# EAGLE design Adafruit EYESPI Pi Beret (EAGLE 9.6.2)
COMPANY: ADAFRUIT INDUSTRIES; DRAWN: K. TOWNSEND; REV: A
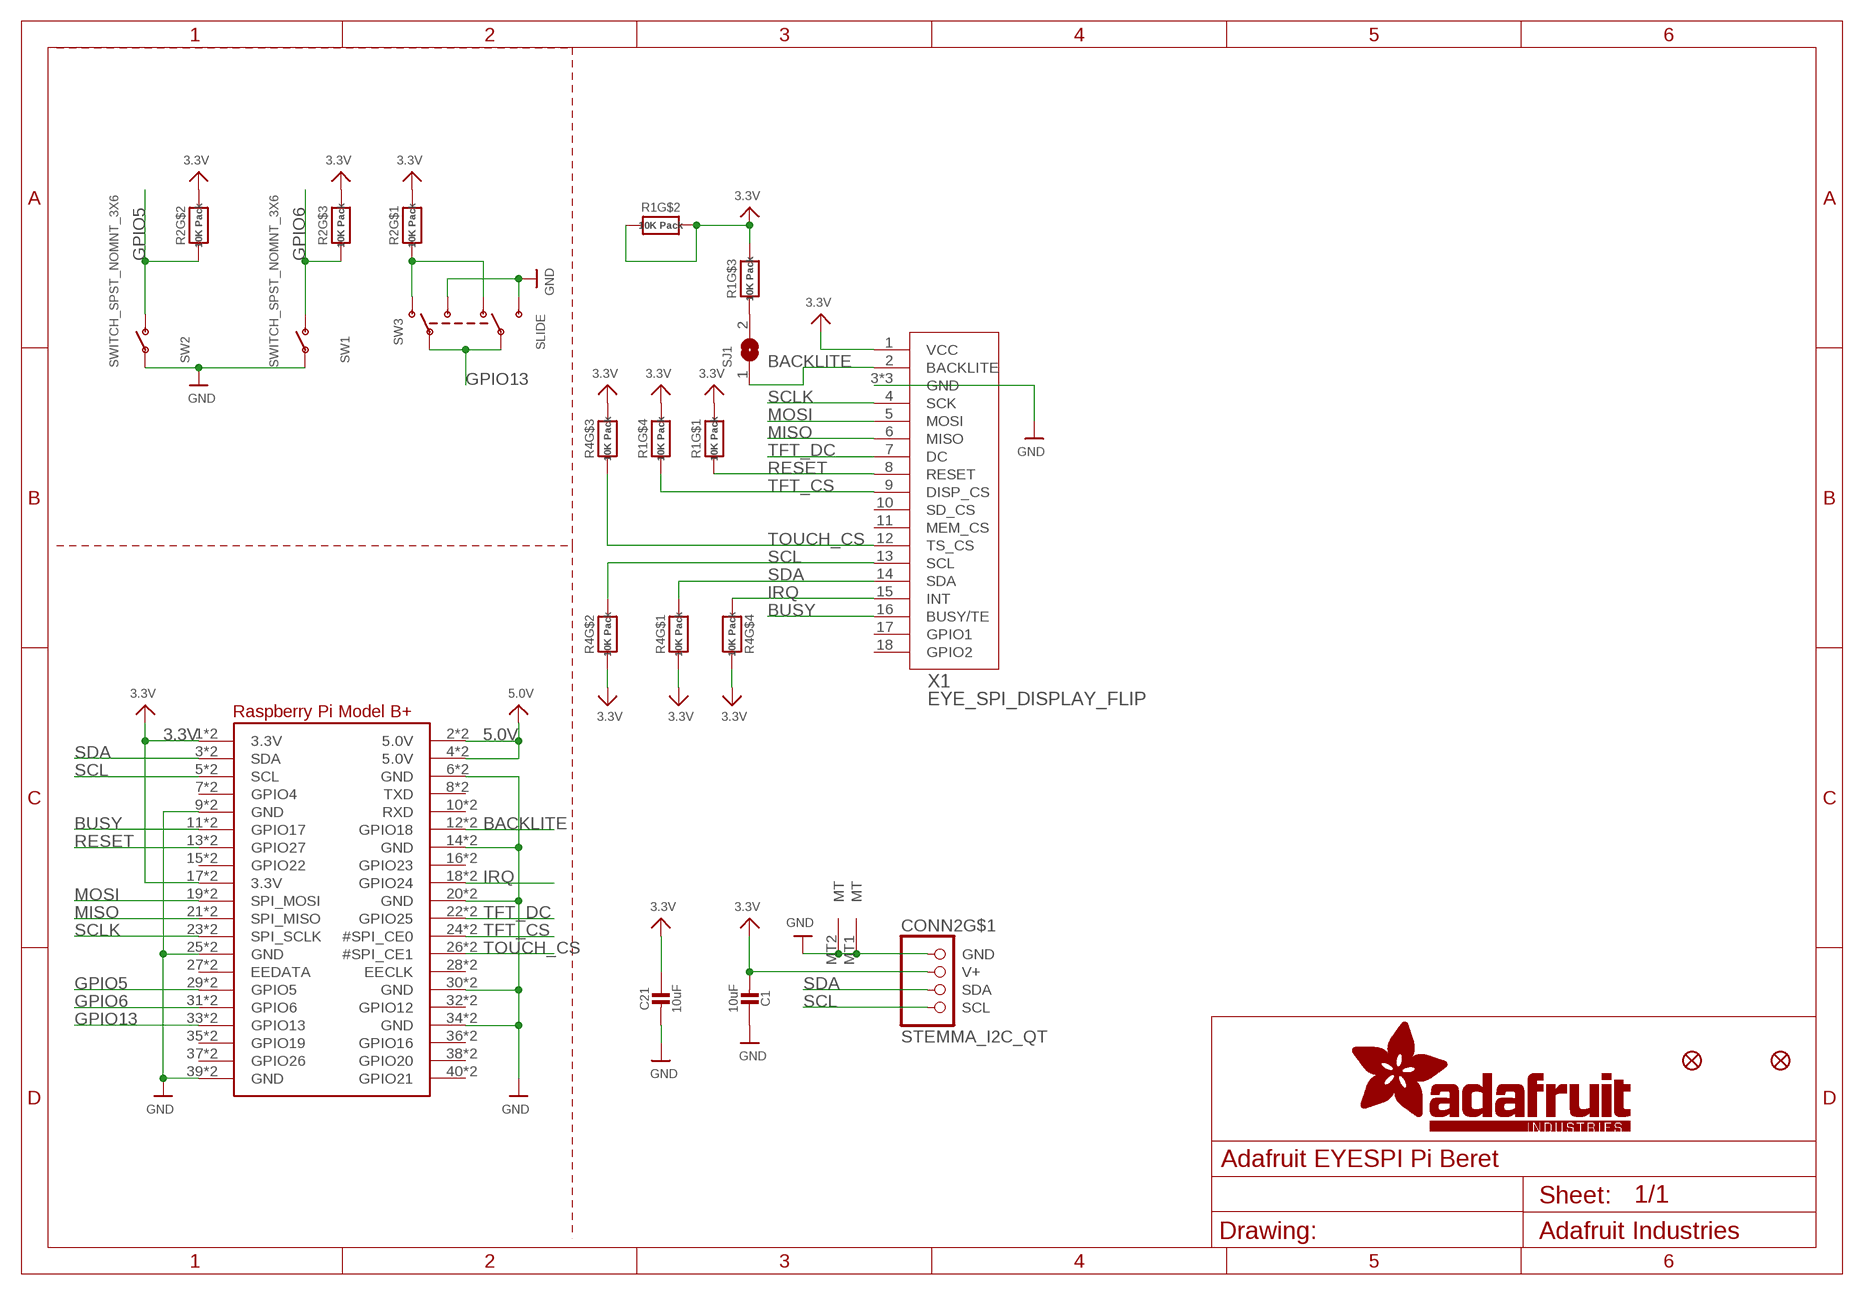
[diagram p0: schematic, sheet 1]

## Parts
C1  10uF  CAP_CERAMIC0805-NOOUTLINE  [0805-NO]
C21  10uF  CAP_CERAMIC0805-NOOUTLINE  [0805-NO]
CONN2  STEMMA_I2C_QT  [JST_SH4]
FID1  FIDUCIAL_1MM  [FIDUCIAL_1MM]
FID4  FIDUCIAL_1MM  [FIDUCIAL_1MM]
R1  10K Pack  RESISTOR_4PACK  [RESPACK_4X0603]
R2  10K Pack  RESISTOR_4PACK  [RESPACK_4X0603]
R4  10K Pack  RESISTOR_4PACK  [RESPACK_4X0603]
RPI2  RASPBERRYPI_BPLUS_2X20_THMSMT  [RASPI_2X20_THMSMT]
SJ1  SOLDERJUMPERCLOSED  [SOLDERJUMPER_CLOSEDWIRE]
SW1  SWITCH_SPST_NOMNT_3X6  [TACTILE_3X6MM]
SW2  SWITCH_SPST_NOMNT_3X6  [TACTILE_3X6MM]
SW3  SLIDE  SWITCH_DPDTEG1390  [EG1390]
X1  EYE_SPI_DISPLAY_FLIP  [EYE_SPI_DISPLAY_BOTCONTACT]

## Nets
3.3V: C1.2 C21.1 CONN2.2(V+) R1.2 R1.5 R1.6 R1.7 R1.8 R2.6 R2.7 R2.8 R4.1 R4.2 R4.5 R4.6 RPI2.1(3.3V) RPI2.17(3.3V) RPI2.S1(3.3V) RPI2.S17(3.3V) X1.1(VCC)
5.0V: RPI2.2(5.0V) RPI2.4(5.0V) RPI2.S2(5.0V) RPI2.S4(5.0V)
BACKLITE: RPI2.12(GPIO18) RPI2.S12(GPIO18) SJ1.1 X1.2(BACKLITE)
BUSY: RPI2.11(GPIO17) RPI2.S11(GPIO17) X1.16(BUSY/TE)
GND: C1.1 C21.2 CONN2.1(GND) CONN2.MT1(MT) CONN2.MT2(MT) RPI2.6(GND) RPI2.9(GND) RPI2.14(GND) RPI2.20(GND) RPI2.25(GND) RPI2.30(GND) RPI2.34(GND) RPI2.39(GND) RPI2.S6(GND) RPI2.S9(GND) RPI2.S14(GND) RPI2.S20(GND) RPI2.S25(GND) RPI2.S30(GND) RPI2.S34(GND) RPI2.S39(GND) SW1.P$1(P) SW2.P$1(P) SW3.S1 SW3.S2 X1.3(GND) X1.SUPPORT1(GND) X1.SUPPORT2(GND)
GPIO5: R2.2 RPI2.29(GPIO5) RPI2.S29(GPIO5) SW2.P$2(S)
GPIO6: R2.3 RPI2.31(GPIO6) RPI2.S31(GPIO6) SW1.P$2(S)
GPIO13: RPI2.33(GPIO13) RPI2.S33(GPIO13) SW3.P1 SW3.P2
IRQ: R4.4 RPI2.18(GPIO24) RPI2.S18(GPIO24) X1.15(INT)
MISO: RPI2.21(SPI_MISO) RPI2.S21(SPI_MISO) X1.6(MISO)
MOSI: RPI2.19(SPI_MOSI) RPI2.S19(SPI_MOSI) X1.5(MOSI)
N$1: R1.3 SJ1.2
N$3: R2.1 SW3.O1 SW3.O2
RESET: R1.1 RPI2.13(GPIO27) RPI2.S13(GPIO27) X1.8(RESET)
SCL: CONN2.4(SCL) R4.7 RPI2.5(SCL) RPI2.S5(SCL) X1.13(SCL)
SCLK: RPI2.23(SPI_SCLK) RPI2.S23(SPI_SCLK) X1.4(SCK)
SDA: CONN2.3(SDA) R4.8 RPI2.3(SDA) RPI2.S3(SDA) X1.14(SDA)
TFT_CS: R1.4 RPI2.24(#SPI_CE0) RPI2.S24(#SPI_CE0) X1.9(DISP_CS)
TFT_DC: RPI2.22(GPIO25) RPI2.S22(GPIO25) X1.7(DC)
TOUCH_CS: R4.3 RPI2.26(#SPI_CE1) RPI2.S26(#SPI_CE1) X1.12(TS_CS)
Unconnected: R2.4 R2.5 RPI2.7(GPIO4) RPI2.8(TXD) RPI2.10(RXD) RPI2.15(GPIO22) RPI2.16(GPIO23) RPI2.27(EEDATA) RPI2.28(EECLK) RPI2.32(GPIO12) RPI2.35(GPIO19) RPI2.36(GPIO16) RPI2.37(GPIO26) RPI2.38(GPIO20) RPI2.40(GPIO21) RPI2.S7(GPIO4) RPI2.S8(TXD) RPI2.S10(RXD) RPI2.S15(GPIO22) RPI2.S16(GPIO23) RPI2.S27(EEDATA) RPI2.S28(EECLK) RPI2.S32(GPIO12) RPI2.S35(GPIO19) RPI2.S36(GPIO16) RPI2.S37(GPIO26) RPI2.S38(GPIO20) RPI2.S40(GPIO21) X1.10(SD_CS) X1.11(MEM_CS) X1.17(GPIO1) X1.18(GPIO2)

## Library data of the parts
C1 C21 = microbuilder:CAP_CERAMIC: Ceramic Capacitors For new designs, use the packages preceded by an '_' character since they are more reliable: The following footprints should be used on most boards: _0402 - Standard footprint for regular board layouts _0603 - Standard footprint for regular board layouts _0805 - Standard footprint for regular board layouts _1206 - Standard footprint for regular board layouts For extremely tight-pitch boards where space is at a premium, the following 'micro-pitch' footprints can be used (smaller pads, no silkscreen outline, etc.): _0402MP - Micro-pitch footprint for very dense/compact boards _0603MP - Micro-pitch footprint for very dense/compact boards _0805MP - Micro-pitch footprint for very dense/compact boards _1206MP - Micro-pitch footprint for very dense/compact boards
CONN2 = adafruit_electromech:STEMMA_I2C; LCSC: C2845363
FID1 FID4 = microbuilder:FIDUCIAL: Fiducial Alignment Points Various fiducial points for machine vision alignment.; BOM: EXCLUDE
R1 R2 R4 = microbuilder:RESISTOR_4PACK: Resistor Packs (4 resistors) 4 x 0603 10K 1/16W - Digikey: YC164J-10KCT-ND
RPI2 = adafruit_sbc:RASPBERRYPI_BPLUS
SJ1 = microbuilder:SOLDERJUMPER: SMD Solder JUMPER Solder the two pads together to create a connection, or remove the solder to break it. REFLOW - Use this footprint for solder paste and reflow ovens. WAVE - Use this footprint for hand-soldering (larger pads). CLOSED - Has a trace between the two pads to ensure it is closed by default. The trace needs to be cut to disable the jumper, and can be closed again by creating a solder bridge between the two pads.
SW1 SW2 = adafruit_electromech:SWITCH_SPST_NOMNT
SW3 = adafruit_electromech:SWITCH_DPDT: Switch - DPDT A DPDT Switch acts like an SPDT switch, but has a pair of switches instead of just one. Vertical - 0.3A @ 6V SMT - Digikey: JS202011SCQN; LCSC: C2837066
X1 = adafruit_display:EYE_SPI_DISPLAY; LCSC: C2856802

## Net classes
1 power: width 0.305 mm

## Board
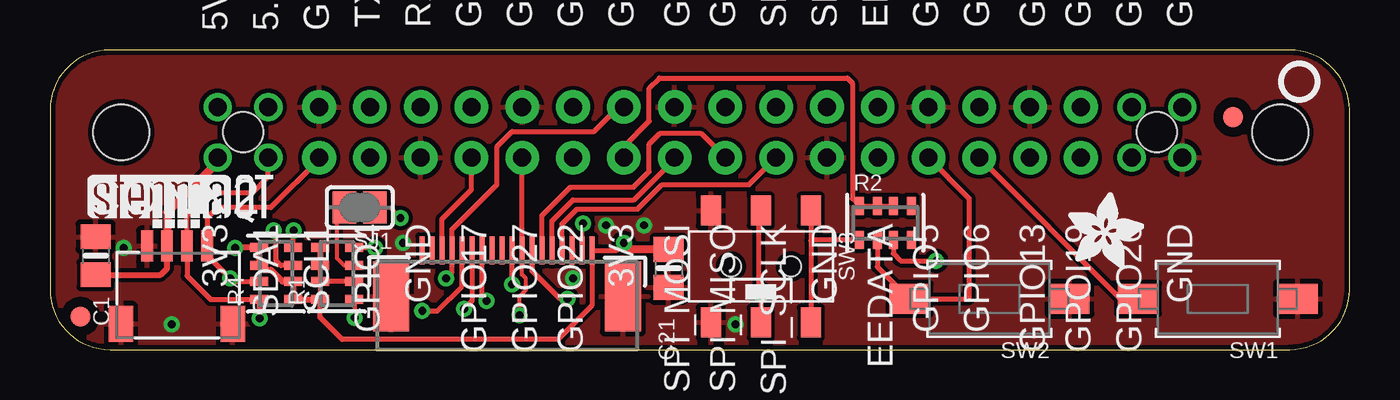
[diagram p1: board, top side]
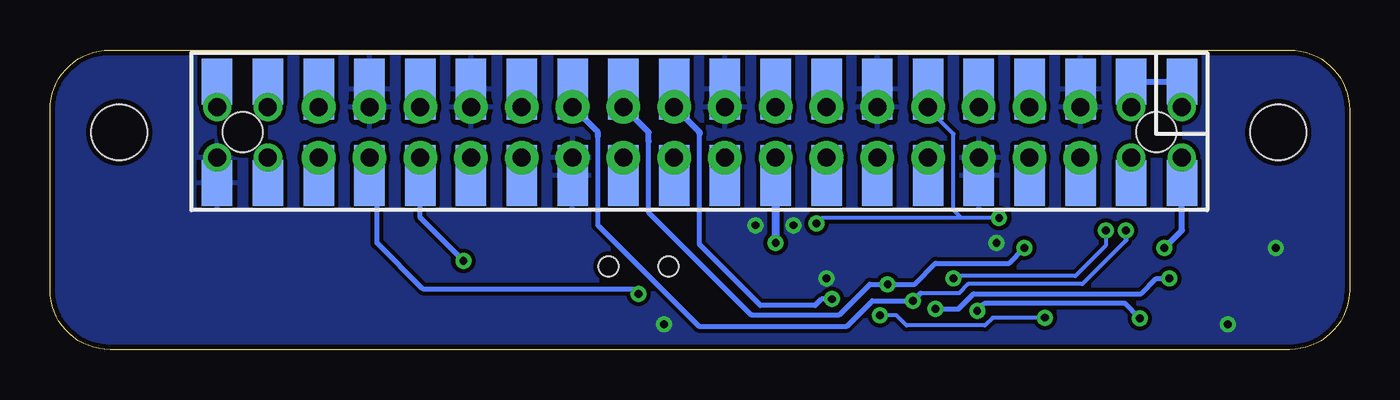
[diagram p2: board, bottom side, seen from below]

Size 65 x 15 mm. Coordinates in mm from the lower left corner, seen from the top.
Outline: 0,12 0,3 arc90 3,0 62,0 arc90 65,3 65,12 arc90 62,15 3,15 arc90 0,12
Copper layers (1*16): Top 0.035mm / dielectric 1.5mm / Bottom 0.035mm
Design rules "adafruit *": minimum track width 8mil, minimum drill 15.5mil, track to track 8mil, track to pad 8mil, pad to pad 8mil, via to via 8mil, smd to smd 8mil, copper to edge 10mil, drill to drill 8mil, minimum pad ring 10mil, minimum via ring 8mil, stop-mask expansion 2mil, vias tented up to drill 20mil, thermal gap 10mil
Holes 2.79 mm at 3.56,10.88 61.53,10.88

### Footprints (pad centres in the part's own frame; a part is rotated, then mirrored left to right if it is on the bottom)
0805-NO = smd 1.24 x 1.5: 1 -0.95,0; 2 0.95,0
JST_SH4 = smd 0.6 x 1.55: 1 -1.5,2.006; 2 -0.5,2.006; 3 0.5,2.006; 4 1.5,2.006 | smd 1.2 x 1.8: MT1 -2.8,-1.894; MT2 2.8,-1.894
FIDUCIAL_1MM = smd 1 x 1: 1 0,0
RESPACK_4X0603 = smd 0.45 x 0.9: 1 -1.3,-0.85; 2 -0.4,-0.85; 3 0.4,-0.85; 4 1.3,-0.85; 5 1.3,0.85; 6 0.4,0.85; 7 -0.4,0.85; 8 -1.3,0.85
RASPI_2X20_THMSMT = drill 0.9 pad 1.27: 1 -24.13,-1.27; 2 -24.13,1.27; 3 -21.59,-1.27; 4 -21.59,1.27; 37 21.59,-1.27; 38 21.59,1.27; 39 24.13,-1.27; 40 24.13,1.27 | drill 0.9 pad 1.676: 5 -19.05,-1.27; 6 -19.05,1.27; 7 -16.51,-1.27; 8 -16.51,1.27; 9 -13.97,-1.27; 10 -13.97,1.27; 11 -11.43,-1.27; 12 -11.43,1.27; 13 -8.89,-1.27; 14 -8.89,1.27; 15 -6.35,-1.27; 16 -6.35,1.27; 17 -3.81,-1.27; 18 -3.81,1.27; 19 -1.27,-1.27; 20 -1.27,1.27; 21 1.27,-1.27; 22 1.27,1.27; 23 3.81,-1.27; 24 3.81,1.27; 25 6.35,-1.27; 26 6.35,1.27; 27 8.89,-1.27; 28 8.89,1.27; 29 11.43,-1.27; 30 11.43,1.27; 31 13.97,-1.27; 32 13.97,1.27; 33 16.51,-1.27; 34 16.51,1.27; 35 19.05,-1.27; 36 19.05,1.27 | smd 1.524 x 2.286 bottom: S1 -24.13,-2.542; S2 -24.13,2.538; S3 -21.59,-2.542; S4 -21.59,2.538; S37 21.59,-2.542; S38 21.59,2.538; S39 24.13,-2.542; S40 24.13,2.538 | smd 1.524 x 3.048 bottom: S5 -19.05,-2.161; S6 -19.05,2.157; S7 -16.51,-2.161; S8 -16.51,2.157; S9 -13.97,-2.161; S10 -13.97,2.157; S11 -11.43,-2.161; S12 -11.43,2.157; S13 -8.89,-2.161; S14 -8.89,2.157; S15 -6.35,-2.161; S16 -6.35,2.157; S17 -3.81,-2.161; S18 -3.81,2.157; S19 -1.27,-2.161; S20 -1.27,2.157; S21 1.27,-2.161; S22 1.27,2.157; S23 3.81,-2.161; S24 3.81,2.157; S25 6.35,-2.161; S26 6.35,2.157; S27 8.89,-2.161; S28 8.89,2.157; S29 11.43,-2.161; S30 11.43,2.157; S31 13.97,-2.161; S32 13.97,2.157; S33 16.51,-2.161; S34 16.51,2.157; S35 19.05,-2.161; S36 19.05,2.157 | hole 2: 22.86,0; -22.86,0
SOLDERJUMPER_CLOSEDWIRE = smd 1.168 x 1.6: 1 -0.762,0; 2 0.762,0 | smd 0.635 x 0.203: WIRE 0,0
TACTILE_3X6MM = smd 2 x 1.5: P$1 -4,0; P$2 4,0
EG1390 = smd 1 x 1.5: O1 -2.5,2.8; O2 -2.5,-2.8; P1 0,2.8; P2 0,-2.8; S1 2.5,2.8; S2 2.5,-2.8 | hole 1: 1.5,0; -1.5,0
EYE_SPI_DISPLAY_BOTCONTACT = smd 0.25 x 1.4: 1 4.25,1.154; 2 3.75,1.154; 3 3.25,1.154; 4 2.75,1.154; 5 2.25,1.154; 6 1.75,1.154; 7 1.25,1.154; 8 0.75,1.154; 9 0.25,1.154; 10 -0.25,1.154; 11 -0.75,1.154; 12 -1.25,1.154; 13 -1.75,1.154; 14 -2.25,1.154; 15 -2.75,1.154; 16 -3.25,1.154; 17 -3.75,1.154; 18 -4.25,1.154 | smd 1.8 x 3.5: SUPPORT1 -5.8,-1.152; SUPPORT2 5.8,-1.152

### Placement (x,y rotation side)
C1  2.29,4.7 270 top
C21  30.94,4.06 270 top
CONN2  6.35,3.17 0 top
FID1  59.18,11.64 0 top
FID4  1.52,1.65 0 top
PLABEL0  [PLABEL0]  46.35,4.83 0 top
PLABEL1  [PLABEL1]  58.04,4.83 0 top
PLABEL2  [PLABEL2]  38.86,0.64 0 top
PLABEL3  [PLABEL3]  18.16,5.97 0 top
PLABEL4  [PLABEL4]  13.59,6.1 90 top
PLABEL5  [PLABEL5]  64.52,4.95 0 bottom
PLABEL6  [PLABEL6]  64.01,0.89 0 bottom
R1  14.35,3.81 90 top
R2  41.78,6.35 0 top
R4  11.3,3.81 90 top
RPI2  32.51,10.88 0 top
SJ1  15.49,7.11 180 top
SW1  58.42,2.54 180 top
SW2  46.99,2.54 180 top
SW3  35.56,4.16 180 top
U$9  [PCBFEAT-REV-040]  62.48,13.42 0 top
U$24  [ADAFRUIT_3.5MM]  50.93,4.06 0 top
U$30  [STEMMAQT]  1.91,6.1 0 top
X1  22.86,3.81 0 top

### Tracks (layer width: path | path; a pad name or v marks a point on that pad's centre or on a via)
3.3V  (via drill 0.39)
  Top 0.254: v28.7,5.33 28.33,4.96 X1.1 27.11,2.22 25.4,0.51 14.61,0.51 13.5,1.61 R1.8 13.5,3.3 | R2.6 R2.7 R2.8 40.13,7.55 40.13,13.34 39.88,13.59 30.48,13.59 29.97,13.08 29.97,11.43 28.7,10.16 RPI2.17 | 13.5,3.3 R1.7 R1.6 | R1.2 13.61,3.41 13.5,3.3
  Top 0.305: R1.5 R1.6 | v9.27,5.08 9.3,5.11 R4.5 R4.6 10.67,3.99 11.05,3.99 11.63,3.41 R4.2 R4.1 R1.8 | C1.2 5.53,3.75 5.85,4.07 CONN2.2
  Top 0.406: RPI2.1 8.38,9.4 5.85,6.87 CONN2.2 | C21.1 29.02,5.01 v28.7,5.33
  Bottom 0.305: v9.27,5.08 8.38,5.97 RPI2.S1 | RPI2.S17 RPI2.17 | RPI2.17
  Bottom 0.406: RPI2.S1 RPI2.1 | RPI2.1 | RPI2.S17 v28.7,5.33 | v28.7,5.33
5.0V
  Bottom 0.305: RPI2.S2 | RPI2.S2 RPI2.2 | RPI2.S4 RPI2.S2 | RPI2.S4 | RPI2.S4 RPI2.4
BACKLITE  (via drill 0.39)
  Top 0.203: SJ1.1 17,7.11 v17.53,6.59 | v26.65,6.31 26.61,6.26 X1.2
  Bottom 0.203: v17.53,6.59 19.41,6.59 | 19.41,6.59 19.81,6.99 19.81,10.79 21.08,12.06 RPI2.12 RPI2.S12 | 19.41,6.59 26.37,6.59 v26.65,6.31 | RPI2.S12
BUSY
  Top 0.254: X1.16 19.61,6.53 21.08,8 RPI2.11
  Bottom 0.305: RPI2.S11 RPI2.11 | RPI2.11
GND  (via drill 0.39)
  Bottom 0.305: RPI2.S39 RPI2.39 | RPI2.39 | RPI2.S34 | RPI2.S34 RPI2.34 | RPI2.S20 | RPI2.S20 RPI2.20 | RPI2.S6 | RPI2.S6 RPI2.6 | RPI2.S9 RPI2.9 | RPI2.9 | RPI2.S14 | RPI2.S14 RPI2.14 | RPI2.S25 RPI2.25 | RPI2.25 | RPI2.S30 | RPI2.S30 RPI2.30
  other vias: 26.16,3.56 6.1,1.27 3.68,5.08 17.65,5.33 27.81,6.22 29.72,6.22 34.29,1.27
  pour Top: 0,14.99 0,0 65.02,0 65.02,14.99
  pour Bottom: 0,14.99 0,0 65.02,0 65.02,14.99
GPIO5
  Top 0.254: RPI2.29 45.97,7.57 45.97,2.54 SW2.P$2 41.38,4.15 R2.2
  Bottom 0.305: RPI2.S29 RPI2.29 | RPI2.29
GPIO6  (via drill 0.39)
  Top 0.254: SW1.P$2 53.55,2.54 RPI2.31 | R2.3 42.18,4.81 42.55,4.45 v44.32,4.45
  Bottom 0.254: v44.32,4.45 46.48,6.6 RPI2.S31
  Bottom 0.305: RPI2.S31 RPI2.31 | RPI2.31
GPIO13  (via drill 0.39)
  Top 0.254: SW3.P2 35.43,6.83 35.43,2.79 v35.56,2.79 SW3.P1
  Bottom 0.254: v35.56,2.79 35.56,3.05 46.35,3.05 48.64,5.33 48.64,8.34 RPI2.S33
  Bottom 0.305: RPI2.S33 RPI2.33 | RPI2.33
IRQ  (via drill 0.39)
  Top 0.254: RPI2.18 28.45,12.15 27.22,10.92 23.11,10.92 22.35,10.16 22.35,8.26 20.11,6.01 X1.15 20.11,3.85 v19.81,3.56 | R4.4 12.15,5.93 v12.19,5.97
  Bottom 0.203: v12.19,5.97 12.19,5.21 13.72,3.68 19.68,3.68
  Bottom 0.254: v19.81,3.56 19.68,3.68
  Bottom 0.305: RPI2.S18 | RPI2.S18 RPI2.18
MISO
  Top 0.254: X1.6 24.61,6.7 26.04,8.13 29.2,8.13 29.97,8.9 29.97,10.29 30.52,10.84 32.55,10.84 RPI2.21
  Bottom 0.305: RPI2.S21 RPI2.21 | RPI2.21
MOSI
  Top 0.254: X1.5 25.11,6.44 26.16,7.49 29.21,7.49 31.24,9.53 RPI2.19
  Bottom 0.305: RPI2.S19 RPI2.19 | RPI2.19
N$1
  Top 0.203: R1.3 14.71,4.21 14.35,4.57 14.35,6.73 SJ1.2
N$3
  Top 0.254: SW3.O2 38.06,5.46 | 38.06,5.46 SW3.O1 | R2.1 38.1,5.5 38.06,5.46
RESET  (via drill 0.39)
  Top 0.203: R1.1 15.24,2.47 v15.24,1.6 | v23.5,1.71 23.5,2.67 23.81,2.98 23.81,3.56 23.61,3.76 X1.8
  Top 0.254: X1.8 23.61,9.59 RPI2.13
  Bottom 0.203: v15.24,1.6 17.84,1.6 18.24,1.2 22.16,1.2 22.67,1.71 v23.5,1.71
  Bottom 0.254: 23.62,7.37 RPI2.S13
  Bottom 0.305: RPI2.S13 RPI2.13 | RPI2.13
SCL  (via drill 0.39)
  Top 0.254: RPI2.5 13.46,9.53 11.05,7.11 8.38,7.11 7.85,6.58 CONN2.4 7.85,4.72 v9.02,3.56 9.16,3.41 R4.7 | X1.13 21.11,2.44 v20.7,2.03
  Bottom 0.254: v20.7,2.03 19.56,2.03 18.8,2.79 10.41,2.79 9.65,3.56 v9.02,3.56
  Bottom 0.406: RPI2.S5 RPI2.5 | RPI2.5
SCLK
  Top 0.254: X1.4 25.61,6.29 26.35,7.04 29.4,7.04 30.62,8.26 34.97,8.26 RPI2.23
  Bottom 0.305: RPI2.S23 RPI2.23 | RPI2.23
SDA  (via drill 0.39)
  Top 0.254: RPI2.3 10.92,8.64 10.16,7.87 8,7.87 6.85,6.72 CONN2.3 6.85,3.69 8.03,2.51 9.89,2.51 R4.8 10.45,1.59 v10.48,1.57 | X1.14 20.61,3.17 19.37,1.94 v18.62,1.94
  Bottom 0.254: v10.48,1.57 11.24,2.33 18.23,2.33 v18.62,1.94
  Bottom 0.406: RPI2.S3 RPI2.3 | RPI2.3
TFT_CS  (via drill 0.39)
  Top 0.254: v23.1,3.27 X1.9 | v16.26,5.08 15.23,5.08 R1.4
  Bottom 0.254: 35.05,10.41 35.05,6.86 29.94,1.75 25.52,1.75 23.99,3.27 v23.1,3.27 21.75,3.27 20.7,4.32 17.02,4.32 v16.26,5.08
  Bottom 0.305: RPI2.S24 | RPI2.S24 RPI2.24 35.05,10.88 35.05,10.41
TFT_DC  (via drill 0.39)
  Top 0.254: X1.7 24.11,3.93 25.51,2.53 v25.89,2.53
  Bottom 0.254: v25.89,2.53 26.4,2.53 26.73,2.2 29.46,2.2 32.51,5.25 32.51,10.79
  Bottom 0.305: RPI2.S22 | RPI2.S22 RPI2.22 32.51,10.88 32.51,10.79
TOUCH_CS  (via drill 0.39)
  Top 0.254: R4.3 11.54,4.21 11.3,4.45 11.3,5.86 v11.19,5.97 | v21.84,2.44 21.61,2.67 X1.12
  Bottom 0.203: 11.19,5.46 13.37,3.28 19.07,3.28 19.53,2.82 21.46,2.82
  Bottom 0.254: v11.19,5.97 11.19,5.46 | 21.46,2.82 v21.84,2.44 23.87,2.44 25.14,1.17 32.54,1.17 37.59,6.22 37.59,10.67
  Bottom 0.305: RPI2.S26 | RPI2.S26 RPI2.26 37.59,10.88 37.59,10.67

### Text on the board
Pinguin_tBackup: BL | EYESPI | 5 | 6 | ladyada / 2.13" Diagonal / E-Ink Display | 13 | SPI+CE0, Busy:17 / Reset:27, DC:22
Pinguin_bBackup: adafruit 2.13" eink bonnet | #5 | EYESPI & Stemma QT Beret for 2x20 Raspberry Pi & SBCs | Busy #17, Lite #18, IRQ #24, DC #25, Reset #27, DispCS CE0, TouchCS CE1 | #6